# EAGLE design powermeting (EAGLE 9.6.2)
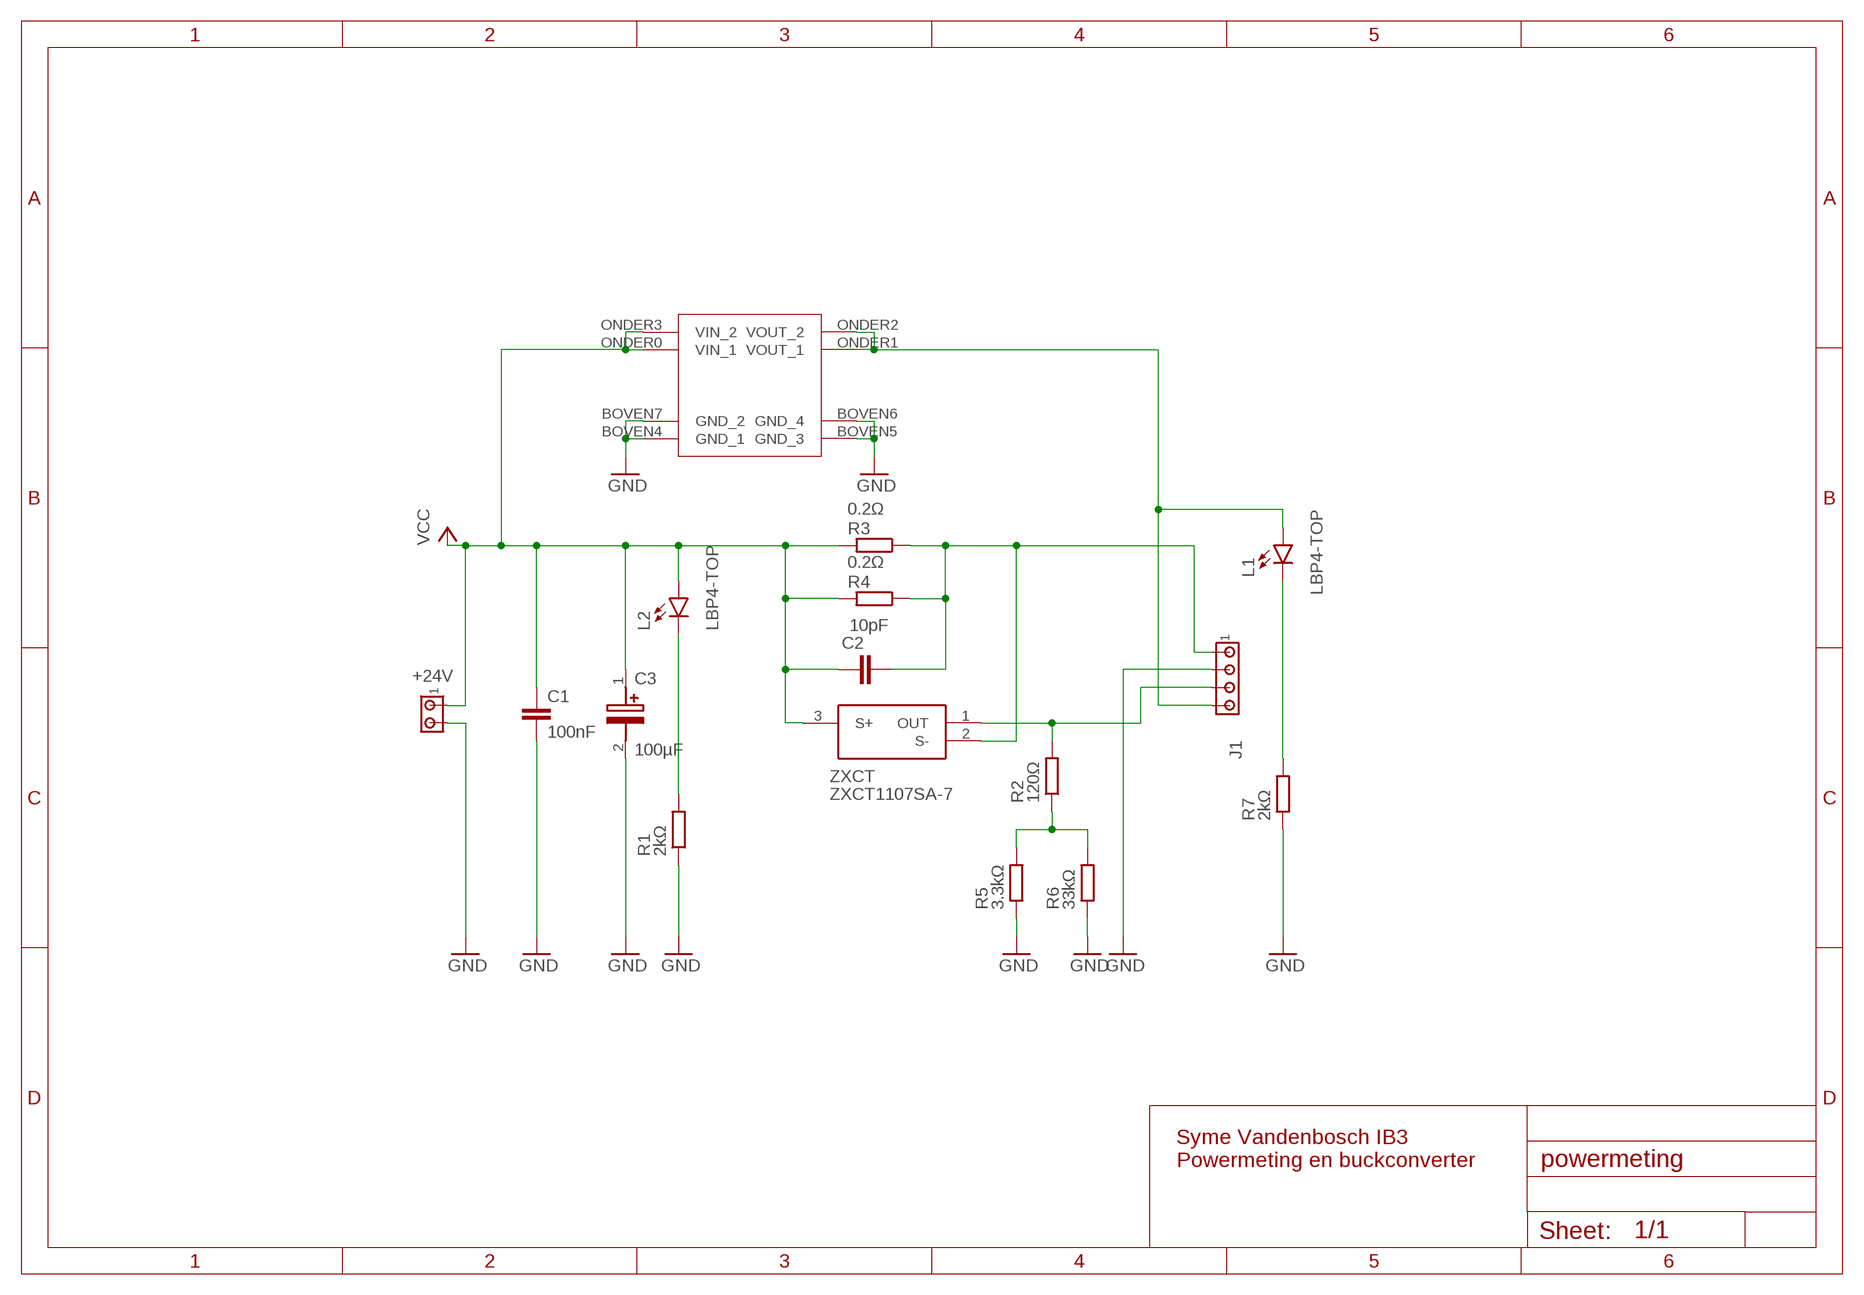
[diagram p0: schematic, sheet 1]

## Parts
+24V  MTA02-100  [10X02MTA]
C1  100nF  C-EUC0805K  [C0805K]
C2  10pF  C-EUC0805K  [C0805K]
C3  100µF  EEH-ZA1H100R  [EEHZA1H100R]
J1  MTA04-100  [10X04MTA]
L1  LBP4-TOP  LED3MM  [LED3MM]
L2  LBP4-TOP  LED3MM  [LED3MM]
R1  2kΩ  R-EU_M0805  [M0805]
R2  120Ω  R-EU_M0805  [M0805]
R3  0.2Ω  R-EU_M1206  [M1206]
R4  0.2Ω  R-EU_M1206  [M1206]
R5  3.3kΩ  R-EU_M0805  [M0805]
R6  33kΩ  R-EU_M0805  [M0805]
R7  2kΩ  R-EU_M0805  [M0805]
U$1  BUCK  [BUCK]
ZXCT  ZXCT1107SA-7  [SOT96P240X110-3N]

## Nets
GND: +24V.2 C1.2 C3.2(-) J1.2 R1.1 R5.1 R6.1 R7.1 U$1.BOVEN4(GND_1) U$1.BOVEN5(GND_3) U$1.BOVEN6(GND_4) U$1.BOVEN7(GND_2)
N$1: L1.K(C) R7.2
N$2: L2.K(C) R1.2
N$3: R2.1 R5.2 R6.2
N$5: C2.2 J1.1 R3.1 R4.1 ZXCT.2(S-)
N$6: J1.4 L1.A U$1.ONDER1(VOUT_1) U$1.ONDER2(VOUT_2)
N$9: J1.3 R2.2 ZXCT.1(OUT)
VCC: +24V.1 C1.1 C2.1 C3.1(+) L2.A R3.2 R4.2 U$1.ONDER0(VIN_1) U$1.ONDER3(VIN_2) ZXCT.3(S+)

## Notes on the sheet
- Syme Vandenbosch IB3
  Powermeting en buckconverter

## Library data of the parts
+24V = con-amp:MTA02-100: AMP connector
C1 C2 = rcl:C-EU: CAPACITOR, European symbol; SPICEPREFIX: C
C3 = EEH-ZA1H100R:EEH-ZA1H100R: Aluminum Organic Polymer Capacitors 10uF 50volt AEC-Q200 Source: Datasheet <http://industrial.panasonic.com/cdbs/www-data/pdf/RDD0000/ABA0000C1221.pdf>; ARROW_PART_NUMBER: EEH-ZA1H100R; ARROW_PRICE-STOCK: https://www.arrow.com/en/products/eehza1h100r/panasonic; DESCRIPTION: Aluminum Organic Polymer Capacitors 10uF 50volt AEC-Q200; HEIGHT: 6.1mm; MANUFACTURER_NAME: Panasonic; MANUFACTURER_PART_NUMBER: EEH-ZA1H100R; MOUSER_PART_NUMBER: 667-EEH-ZA1H100R; MOUSER_PRICE-STOCK: https://www.mouser.co.uk/ProductDetail/Panasonic/EEH-ZA1H100R?qs=7UCyOFMWVHYLkHnrAgGq6g%3D%3D
J1 = con-amp:MTA04-100: AMP connector
L1 L2 = led:LED: LED OSRAM: - CHIPLED LG R971, LG N971, LY N971, LG Q971, LY Q971, LO R971, LY R971 LH N974, LH R974 LS Q976, LO Q976, LY Q976 LO Q996 - Hyper CHIPLED LW Q18S LB Q993, LB Q99A, LB R99A - SideLED LS A670, LO A670, LY A670, LG A670, LP A670 LB A673, LV A673, LT A673, LW A673 LH A674 LY A675 LS A676, LA A676, LO A676, LY A676, LW A676 LS A679, LY A679, LG A679 - Hyper Micro SIDELED® LS Y876, LA Y876, LO Y876, LY Y876 LT Y87S - SmartLED LW L88C, LW L88S LB L89C, LB L89S, LG L890 LS L89K, LO L89K, LY L89K LS L896, LA L896, LO L896, LY L896 - TOPLED LS T670, LO T670, LY T670, LG T670, LP T670 LSG T670, LSP T670, LSY T670, LOP T670, LYG T670 LG T671, LOG T671, LSG T671 LB T673, LV T673, LT T673, LW T673 LH T674 LS T676, LA T676, LO T676, LY T676, LB T676, LH T676, LSB T676, LW T676 LB T67C, LV T67C, LT T67C, LS T67K, LO T67K, LY T67K, LW E67C LS E67B, LA E67B, LO E67B, LY E67B, LB E67C, LV E67C, LT E67C LW T67C LS T679, LY T679, LG T679 LS T770, LO T770, LY T770, LG T770, LP T770 LB T773, LV T773, LT T773, LW T773 LH T774 LS E675, LA E675, LY E675, LS T675 LS T776, LA T776, LO T776, LY T776, LB T776 LHGB T686 LT T68C, LB T68C - Hyper Mini TOPLED® LB M676 - Mini TOPLED Santana® LG M470 LS M47K, LO M47K, LY M47K Source: http://www.osram.convergy.de LUXEON: - LUMILED® LXK2-PW12-R00, LXK2-PW12-S00, LXK2-PW14-U00, LXK2-PW14-V00 LXK2-PM12-R00, LXK2-PM12-S00, LXK2-PM14-U00 LXK2-PE12-Q00, LXK2-PE12-R00, LXK2-PE12-S00, LXK2-PE14-T00, LXK2-PE14-U00 LXK2-PB12-K00, LXK2-PB12-L00, LXK2-PB12-M00, LXK2-PB14-N00, LXK2-PB14-P00, LXK2-PB14-Q00 LXK2-PR12-L00, LXK2-PR12-M00, LXK2-PR14-Q00, LXK2-PR14-R00 LXK2-PD12-Q00, LXK2-PD12-R00, LXK2-PD12-S00 LXK2-PH12-R00, LXK2-PH12-S00 LXK2-PL12-P00, LXK2-PL12-Q00, LXK2-PL12-R00 Source: www.luxeon.com KINGBRIGHT: KA-3528ASYC Source: www.kingbright.com
R1-R7 = rcl:R-EU_: RESISTOR, European symbol; SPICEPREFIX: R
U$1 = buck:BUCK
ZXCT = ZXCT1107SA-7:ZXCT1107SA-7: Current Monitor 2.5-36V 3% Iout SOT23 DiodesZetex ZXCT1107SA-7, Current Monitor Source: Datasheet <https://www.diodes.com//assets/Datasheets/ZXCT1107_10.pdf>; ARROW_PART_NUMBER: ZXCT1107SA-7; ARROW_PRICE-STOCK: https://www.arrow.com/en/products/zxct1107sa-7/diodes-incorporated?region=nac; DESCRIPTION: Current Monitor 2.5-36V 3% Iout SOT23 DiodesZetex ZXCT1107SA-7, Current Monitor; HEIGHT: 1.1mm; MANUFACTURER_NAME: Diodes Incorporated; MANUFACTURER_PART_NUMBER: ZXCT1107SA-7; MOUSER_PART_NUMBER: 522-ZXCT1107SA-7; MOUSER_PRICE-STOCK: https://www.mouser.co.uk/ProductDetail/Diodes-Incorporated/ZXCT1107SA-7?qs=E5c5%252Bmu3i38jsClLlS4FvA%3D%3D

## Board
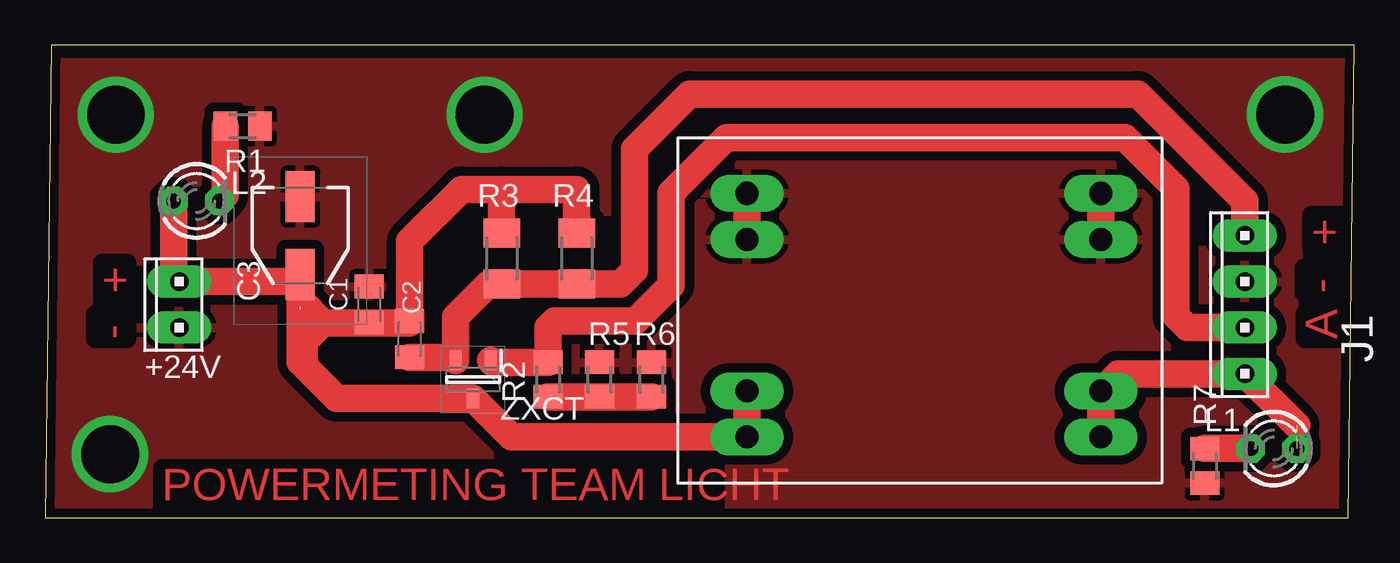
[diagram p1: board, top side]

Size 72.14 x 26.04 mm. Coordinates in mm from the lower left corner, seen from the top.
Outline: 0,0 71.82,0 72.14,26.04 0.32,26.04 0,0
Copper layers (1*16): Top 0.035mm / dielectric 1.5mm / Bottom 0.035mm
Design rules "default *": minimum track width 6mil, minimum drill 0.35mm, track to track 20mil, track to pad 15mil, pad to pad 15mil, via to via 6mil, smd to smd 10mil, copper to edge 20mil, drill to drill 5mil, minimum pad ring 15mil, minimum via ring 20mil, stop-mask expansion 4mil, vias tented up to drill 0mil, thermal gap 12mil

### Footprints (pad centres in the part's own frame; a part is rotated, then mirrored left to right if it is on the bottom)
10X02MTA = drill 1.016 long: 1 1.27,0; 2 -1.27,0
C0805K = smd 1.3 x 1.6: 1 -1,0; 2 1,0
EEHZA1H100R = smd 2.8 x 1.6: 1 -2.15,0; 2 2.15,0
10X04MTA = drill 1.016 long: 1 3.81,0; 2 1.27,0; 3 -1.27,0; 4 -3.81,0
LED3MM = drill 0.813 octagon: A -1.27,0; K 1.27,0
M0805 = smd 1.3 x 1.6: 1 -0.95,0; 2 0.95,0
M1206 = smd 1.6 x 2: 1 -1.4,0; 2 1.4,0
BUCK = drill 1.27 pad 2.032 long: BOVEN4 0,10.9; BOVEN5 19.51,10.9; BOVEN6 19.51,13.44; BOVEN7 0,13.44; ONDER0 0,0; ONDER1 19.51,0; ONDER2 19.51,2.54; ONDER3 0,2.54
SOT96P240X110-3N = smd 1.1 x 0.65: 1 -1.05,0.96; 2 -1.05,-0.96; 3 1.05,0

### Placement (x,y rotation side)
+24V  7.38,11.75 90 top
C1  17.86,11.75 90 top
C2  20.08,9.84 270 top
C3  14.05,15.56 90 top
J1  66.12,11.75 90 top
L1  67.7,3.81 180 top
L2  8.33,17.46 0 top
R1  10.87,21.59 180 top
R2  27.7,7.62 90 top
R3  25.16,14.29 90 top
R4  29.29,14.29 90 top
R5  30.56,7.62 270 top
R6  33.41,7.62 270 top
R7  63.89,2.86 90 top
U$1  38.67,4.45 0 top
ZXCT  23.57,7.62 270 top

### Tracks (layer width: path | path; a pad name or v marks a point on that pad's centre or on a via)
GND  (via drill 3.17, 3.17 pad 1.3, 3.2)
  Top 1.27: v3.57,3.49 3.57,3.17
  Top 1.524: U$1.BOVEN4 U$1.BOVEN7 | U$1.BOVEN5 U$1.BOVEN6
  other vias: 68.34,22.22 3.89,22.22 24.21,22.22
  pour Top: 0.42,25.08 0.42,0.64 71.83,0.64 71.83,25.08
N$1
  Top 1.524: R7.2 L1.K
N$2
  Top 1.524: L2.K 9.92,17.78 R1.2
N$3
  Top 1.524: R6.2 R5.2 R2.1
N$5
  Top 1.524: C2.2 22.44,8.84 ZXCT.2 22.61,11.06 24.44,12.89 R3.1 R4.1 31.7,12.89 32.46,13.65 32.46,20.32 35.51,23.36 60.21,23.36 66.12,17.46 J1.1
N$6  (1 unrouted)
  Top 1.524: U$1.ONDER1 U$1.ONDER2 59.13,7.94 J1.4 68.97,5.08
N$9
  Top 1.524: J1.3 62.94,10.48 62.31,11.11 62.31,18.14 59.5,20.95 37.54,20.95 34.49,17.91 34.49,12.81 32.54,10.86 28.08,10.86 27.7,10.48 R2.2 | 27.6,8.67 R2.2 | R2.2 24.63,8.57 ZXCT.1
VCC
  Top 1.27: +24V.1 13.66,13.02 C3.1 14.05,12.7 14.05,12.07 | 14.05,12.07 14.05,11.43 | 14.05,11.43 14.63,10.84 | 14.63,10.84 14.63,10.43 14.05,9.84 | 14.05,11.43 14.05,9.84 | 14.05,9.84 14.05,8.57 14.36,8.25 14.36,9.8 | 20.08,10.75 C2.1 | 19.76,10.75 C1.1 15.32,10.75 14.73,10.75 14.63,10.84 | 14.63,10.84 14.63,11.48 | 14.63,11.48 14.05,12.07 | 14.63,11.48 15.32,10.8
  Top 1.524: 14.05,12.7 13.73,13.02 +24V.1 7.06,13.34 L2.A | 14.05,12.02 14.05,8.57 | 14.36,8.25 16.05,6.57 ZXCT.3 25.7,4.45 U$1.ONDER0 U$1.ONDER3 | C3.1 14.05,12.07 14.05,12.02 | 14.05,12.02 15.32,10.75 | 15.32,10.75 15.32,10.8 15.36,10.75 19.76,10.75 20.08,10.75 | 15.32,10.75 14.36,9.8 | C2.1 20.08,15.24 22.94,18.1 25.16,18.1 | 25.16,18.1 29.29,18.1 R4.2 | R3.2 25.16,18.1

### Text on the board
Top: + | - | + | - | A | POWERMETING TEAM LICHT